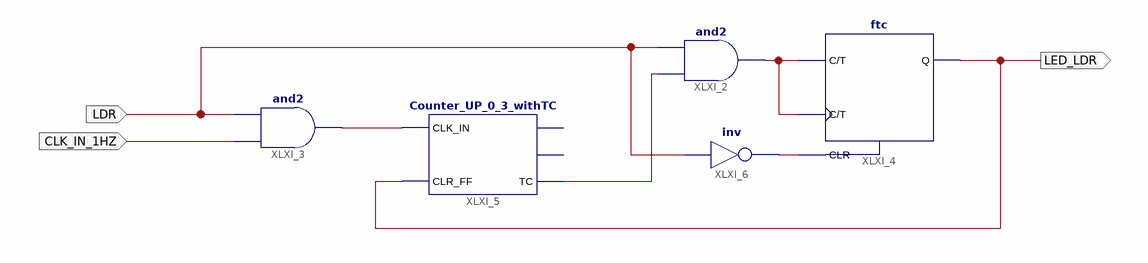
[diagram p0: schematic sheet 1]
// Xilinx ISE schematic LDR_LED.sch (spartan6) as structural Verilog: 5 symbols, 3 ports
module LDR_LED (
  input  CLK_IN_1HZ,
  input  LDR,
  output LED_LDR
);

  wire XLXN_3, XLXN_7, XLXN_17, XLXN_19;

  and XLXI_2 (XLXN_19, XLXN_7, LDR);
  and XLXI_3 (XLXN_3, CLK_IN_1HZ, LDR);
  ftc XLXI_4 (.C(XLXN_19), .CLR(XLXN_17), .T(XLXN_19), .Q(LED_LDR));
  Counter_UP_0_3_withTC XLXI_5 (.CLK_IN(XLXN_3), .CLR_FF(LED_LDR), .TC(XLXN_7));  // open: D0, D1
  not XLXI_6 (XLXN_17, LDR);
endmodule
